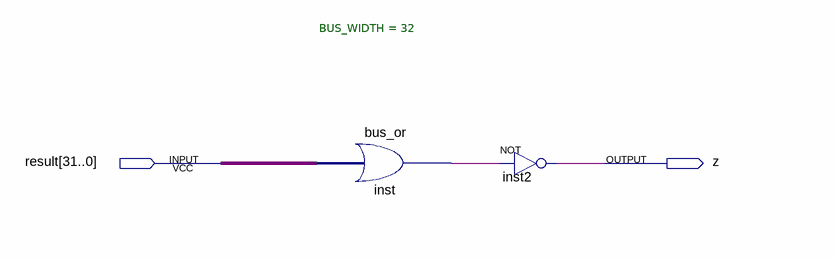
[diagram p0: schematic sheet]
// Quartus schematic uc_zero.bdf as structural Verilog: 2 symbols, 2 pins
module uc_zero (
  input  [31:0] result,
  output z
);

  wire inst_out;

  bus_or #(.BUS_WIDTH(32)) inst (.in(result), .out(inst_out));
  not inst2 (z, inst_out);
endmodule
